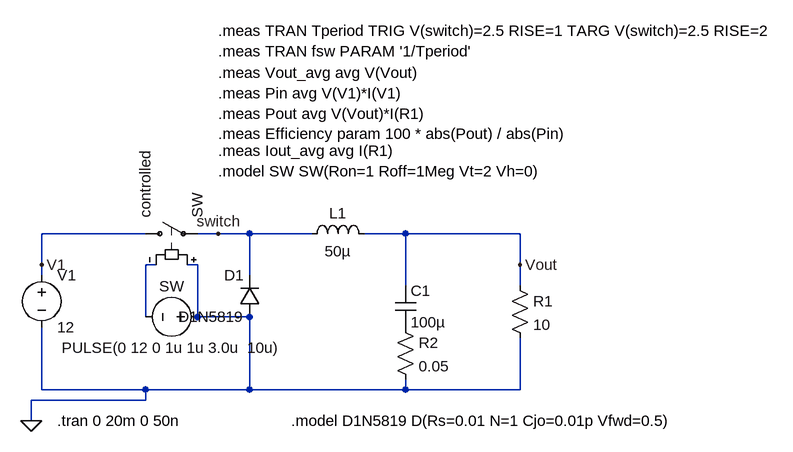
[diagram p0: schematic buck_conv_proj1.asc]
buck_conv_proj1.asc, the LTspice schematic file:
Version 4.1
SHEET 1 1100 680
WIRE -544 -32 -704 -32
WIRE -432 -32 -464 -32
WIRE -384 -32 -432 -32
WIRE -288 -32 -384 -32
WIRE -144 -32 -208 -32
WIRE 32 -32 -144 -32
WIRE -704 16 -704 -32
WIRE -528 16 -544 16
WIRE -464 16 -480 16
WIRE 32 16 32 -32
WIRE -704 32 -704 16
WIRE -384 32 -384 -32
WIRE -144 48 -144 -32
WIRE 32 48 32 16
WIRE -544 96 -544 16
WIRE -464 96 -464 16
WIRE -384 96 -464 96
WIRE -704 208 -704 112
WIRE -544 208 -704 208
WIRE -384 208 -384 96
WIRE -384 208 -544 208
WIRE -144 208 -144 192
WIRE -144 208 -384 208
WIRE 32 208 32 128
WIRE 32 208 -144 208
WIRE -544 224 -544 208
WIRE -544 224 -720 224
WIRE -720 256 -720 224
FLAG -720 256 0
FLAG 32 16 Vout
FLAG -704 16 V1
FLAG -432 -32 switch
SYMBOL voltage -704 16 R0
SYMATTR InstName V1
SYMATTR Value 12
SYMBOL sw -560 -32 R270
SYMATTR InstName controlled
SYMBOL diode -368 96 R180
WINDOW 0 24 64 Left 2
WINDOW 3 24 0 Left 2
SYMATTR InstName D1
SYMATTR Value D1N5819
SYMBOL ind -304 -16 R270
WINDOW 0 32 56 VTop 2
WINDOW 3 5 56 VBottom 2
SYMATTR InstName L1
SYMATTR Value 50µ
SYMBOL cap -160 48 R0
SYMATTR InstName C1
SYMATTR Value 100µ
SYMBOL res 16 32 R0
SYMATTR InstName R1
SYMATTR Value 10
SYMBOL voltage -448 96 R90
WINDOW 0 -32 56 VBottom 2
WINDOW 3 32 56 VTop 2
WINDOW 123 0 0 Left 0
WINDOW 39 0 0 Left 0
SYMATTR InstName SW
SYMATTR Value PULSE(0 12 0 1u 1u 3.0u  10u)
SYMBOL res -160 96 R0
SYMATTR InstName R2
SYMATTR Value 0.05
TEXT -680 256 Left 2 !.tran 0 20m 0 50n
TEXT -432 -128 Left 2 !.model SW SW(Ron=1 Roff=1Meg Vt=2 Vh=0)
TEXT -320 256 Left 2 !.model D1N5819 D(Rs=0.01 N=1 Cjo=0.01p Vfwd=0.5)
TEXT -432 -248 Left 2 !.meas Pin avg V(V1)*I(V1)\n.meas Pout avg V(Vout)*I(R1)\n.meas Efficiency param 100 * abs(Pout) / abs(Pin)
TEXT -432 -160 Left 2 !.meas Iout_avg avg I(R1)
TEXT -432 -280 Left 2 !.meas Vout_avg avg V(Vout)
TEXT -432 -344 Left 2 !.meas TRAN Tperiod TRIG V(switch)=2.5 RISE=1 TARG V(switch)=2.5 RISE=2\n.meas TRAN fsw PARAM '1/Tperiod'

The netlist it stands for:
* buck_conv_proj1.asc
V1 V1 0 12
S§controlled V1 switch 0 N001 SW
D1 0 switch D1N5819
L1 switch Vout 50µ
C1 Vout P001 100µ
R1 Vout 0 10
V§SW 0 N001 PULSE(0 12 0 1u 1u 3.0u  10u)
R2 P001 0 0.05
.model D D
.lib standard.dio
.tran 0 20m 0 50n
.model SW SW(Ron=1 Roff=1Meg Vt=2 Vh=0)
.model D1N5819 D(Rs=0.01 N=1 Cjo=0.01p Vfwd=0.5)
.meas Pin avg V(V1)*I(V1)
.meas Pout avg V(Vout)*I(R1)
.meas Efficiency param 100 * abs(Pout) / abs(Pin)
.meas Iout_avg avg I(R1)
.meas Vout_avg avg V(Vout)
.meas TRAN Tperiod TRIG V(switch)=2.5 RISE=1 TARG V(switch)=2.5 RISE=2
.meas TRAN fsw PARAM '1/Tperiod'
.backanno
.end